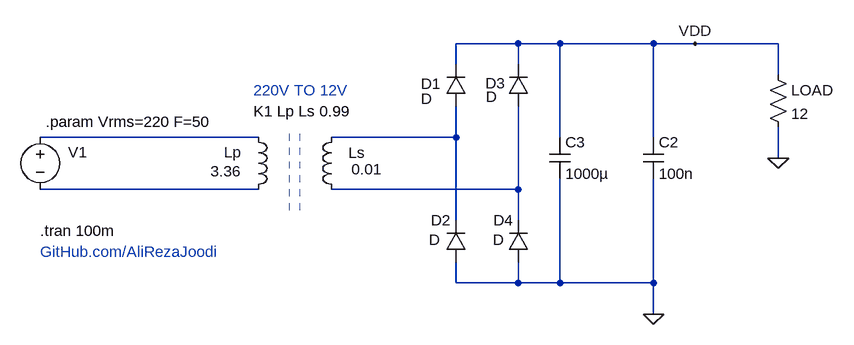
[diagram p0: schematic v1.0.asc]
v1.0.asc, the LTspice schematic file:
Version 4.1
SHEET 1 1736 680
WIRE 384 16 288 16
WIRE 448 16 384 16
WIRE 592 16 448 16
WIRE 656 16 592 16
WIRE 784 16 656 16
WIRE 288 48 288 16
WIRE 384 48 384 16
WIRE 784 64 784 16
WIRE -16 160 -352 160
WIRE 288 160 288 112
WIRE 288 160 96 160
WIRE 448 160 448 16
WIRE 592 160 592 16
WIRE 784 192 784 144
WIRE -16 240 -352 240
WIRE 384 240 384 112
WIRE 384 240 96 240
WIRE 288 288 288 160
WIRE 384 288 384 240
WIRE 288 384 288 352
WIRE 384 384 384 352
WIRE 384 384 288 384
WIRE 448 384 448 224
WIRE 448 384 384 384
WIRE 592 384 592 224
WIRE 592 384 448 384
WIRE 592 432 592 384
FLAG 656 16 VDD
FLAG 592 432 0
FLAG 784 192 0
SYMBOL voltage -352 144 R0
WINDOW 0 43 39 Left 2
WINDOW 3 -248 72 Invisible 2
WINDOW 123 0 0 Left 0
WINDOW 39 -162 108 Left 2
SYMATTR InstName V1
SYMATTR Value SINE(0 {Vrms*1.414} {F})
SYMBOL diode 304 112 R180
WINDOW 0 39 34 Left 2
WINDOW 3 53 11 Left 2
SYMATTR InstName D1
SYMBOL diode 304 352 R180
WINDOW 0 24 64 Left 2
WINDOW 3 40 34 Left 2
SYMATTR InstName D2
SYMBOL diode 400 112 R180
WINDOW 0 36 35 Left 2
WINDOW 3 49 14 Left 2
SYMATTR InstName D3
SYMBOL diode 400 352 R180
WINDOW 0 24 64 Left 2
WINDOW 3 38 34 Left 2
SYMATTR InstName D4
SYMBOL cap 576 160 R0
SYMATTR InstName C2
SYMATTR Value 100n
SYMBOL cap 432 160 R0
SYMATTR InstName C3
SYMATTR Value 1000µ
SYMBOL ind -32 256 M180
WINDOW 0 -37 73 Left 2
WINDOW 3 -58 44 Left 2
SYMATTR InstName Lp
SYMATTR Value 3.36
SYMATTR Type ind
SYMATTR SpiceLine Ipk=0.2 Rser=82 Rpar=48k
SYMBOL ind 112 256 R180
WINDOW 0 -36 72 Left 2
WINDOW 3 -15 47 Right 2
SYMATTR InstName Ls
SYMATTR Value 0.01
SYMATTR Type ind
SYMATTR SpiceLine Ipk=3 Rser=0.6
SYMBOL res 768 48 R0
SYMATTR InstName LOAD
SYMATTR Value 12
TEXT -352 304 Left 2 !.tran 100m
TEXT -24 120 Left 2 !K1 Lp Ls 0.99
TEXT -24 88 Left 2 ;220V TO 12V
TEXT -344 136 Left 2 !.param Vrms=220 F=50
TEXT -352 336 Left 2 ;GitHub.com/AliRezaJoodi
LINE Normal 32 272 32 144 2
LINE Normal 32 272 32 144 2
LINE Normal 48 272 48 144 2

The netlist it stands for:
* v1.0.asc
V1 N001 N003 SINE(0 {Vrms*1.414} {F})
D1 N002 VDD D
D2 0 N002 D
D3 N004 VDD D
D4 0 N004 D
C2 VDD 0 100n
C3 VDD 0 1000µ
Lp N003 N001 3.36 Ipk=0.2 Rser=82 Rpar=48k
Ls N004 N002 0.01 Ipk=3 Rser=0.6
R§LOAD VDD 0 12
.model D D
.lib standard.dio
.tran 100m
K1 Lp Ls 0.99
* 220V TO 12V
.param Vrms=220 F=50
* GitHub.com/AliRezaJoodi
.backanno
.end